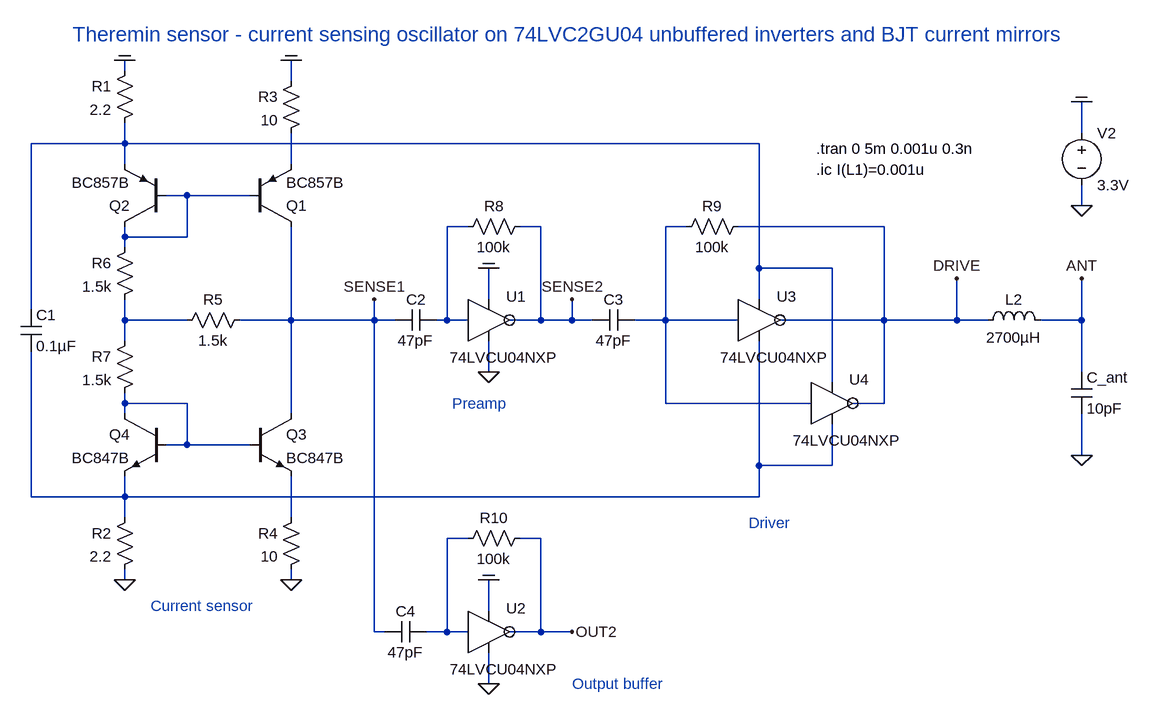
[diagram p0: schematic 2021_current_sensing_unbuffered_inverters_06.asc]
2021_current_sensing_unbuffered_inverters_06.asc, the LTspice schematic file:
Version 4
SHEET 1 13280 8692
WIRE 2560 5792 2560 5776
WIRE 2816 5808 2816 5776
WIRE 4032 5888 4032 5840
WIRE 2560 5904 2560 5872
WIRE 2560 5904 2416 5904
WIRE 3536 5904 2560 5904
WIRE 2560 5936 2560 5904
WIRE 2816 5936 2816 5888
WIRE 2656 5984 2624 5984
WIRE 2752 5984 2656 5984
WIRE 4032 6000 4032 5968
WIRE 3088 6032 3056 6032
WIRE 3200 6032 3168 6032
WIRE 3424 6032 3392 6032
WIRE 3728 6032 3504 6032
WIRE 2560 6048 2560 6032
WIRE 2656 6048 2656 5984
WIRE 2656 6048 2560 6048
WIRE 2560 6064 2560 6048
WIRE 3536 6096 3536 5904
WIRE 3648 6096 3536 6096
WIRE 3120 6144 3120 6096
WIRE 3536 6144 3536 6096
WIRE 2416 6160 2416 5904
WIRE 2560 6176 2560 6144
WIRE 2656 6176 2560 6176
WIRE 2816 6176 2816 6032
WIRE 2816 6176 2736 6176
WIRE 2944 6176 2944 6144
WIRE 2944 6176 2816 6176
WIRE 2976 6176 2944 6176
WIRE 3056 6176 3056 6032
WIRE 3056 6176 3040 6176
WIRE 3088 6176 3056 6176
WIRE 3200 6176 3200 6032
WIRE 3200 6176 3152 6176
WIRE 3248 6176 3248 6144
WIRE 3248 6176 3200 6176
WIRE 3280 6176 3248 6176
WIRE 3392 6176 3392 6032
WIRE 3392 6176 3344 6176
WIRE 3504 6176 3392 6176
WIRE 3728 6176 3728 6032
WIRE 3728 6176 3568 6176
WIRE 3840 6176 3840 6112
WIRE 3840 6176 3728 6176
WIRE 3888 6176 3840 6176
WIRE 4032 6176 4032 6112
WIRE 4032 6176 3968 6176
WIRE 2560 6208 2560 6176
WIRE 3120 6256 3120 6208
WIRE 4032 6256 4032 6176
WIRE 3648 6272 3648 6096
WIRE 2560 6304 2560 6288
WIRE 2656 6304 2560 6304
WIRE 3392 6304 3392 6176
WIRE 3616 6304 3392 6304
WIRE 3728 6304 3728 6176
WIRE 3728 6304 3680 6304
WIRE 2560 6320 2560 6304
WIRE 2816 6320 2816 6176
WIRE 2656 6368 2656 6304
WIRE 2656 6368 2624 6368
WIRE 2752 6368 2656 6368
WIRE 4032 6384 4032 6320
WIRE 3536 6400 3536 6208
WIRE 3648 6400 3648 6336
WIRE 3648 6400 3536 6400
WIRE 2416 6448 2416 6224
WIRE 2560 6448 2560 6416
WIRE 2560 6448 2416 6448
WIRE 3536 6448 3536 6400
WIRE 3536 6448 2560 6448
WIRE 2560 6480 2560 6448
WIRE 2816 6480 2816 6416
WIRE 3088 6512 3056 6512
WIRE 3200 6512 3168 6512
WIRE 2560 6576 2560 6560
WIRE 2816 6576 2816 6560
WIRE 3120 6624 3120 6576
WIRE 2944 6656 2944 6176
WIRE 2960 6656 2944 6656
WIRE 3056 6656 3056 6512
WIRE 3056 6656 3024 6656
WIRE 3088 6656 3056 6656
WIRE 3200 6656 3200 6512
WIRE 3200 6656 3152 6656
WIRE 3248 6656 3200 6656
WIRE 3120 6736 3120 6688
FLAG 4032 6000 0
FLAG 4032 5840 COM
FLAG 2816 5776 COM
FLAG 2816 6576 0
FLAG 3120 6096 COM
FLAG 3120 6256 0
FLAG 3248 6144 SENSE2
FLAG 2560 5776 COM
FLAG 2560 6576 0
FLAG 4032 6112 ANT
FLAG 4032 6384 0
FLAG 3840 6112 DRIVE
FLAG 3120 6576 COM
FLAG 3120 6736 0
FLAG 3248 6656 OUT2
FLAG 2944 6144 SENSE1
SYMBOL voltage 4032 5872 R0
WINDOW 123 0 0 Left 2
WINDOW 39 0 0 Left 2
SYMATTR InstName V2
SYMATTR Value 3.3V
SYMBOL pnp 2752 6032 M180
SYMATTR InstName Q1
SYMATTR Value BC857B
SYMBOL pnp 2624 6032 R180
SYMATTR InstName Q2
SYMATTR Value BC857B
SYMBOL npn 2752 6320 R0
SYMATTR InstName Q3
SYMATTR Value BC847B
SYMBOL npn 2624 6320 M0
SYMATTR InstName Q4
SYMATTR Value BC847B
SYMBOL res 2752 6160 R90
WINDOW 0 0 56 VBottom 2
WINDOW 3 32 56 VTop 2
SYMATTR InstName R5
SYMATTR Value 1.5k
SYMBOL res 2832 5792 M0
WINDOW 0 36 40 Left 2
WINDOW 3 36 76 Left 2
SYMATTR InstName R3
SYMATTR Value 10
SYMBOL res 2832 6464 M0
WINDOW 0 36 40 Left 2
WINDOW 3 36 76 Left 2
SYMATTR InstName R4
SYMATTR Value 10
SYMBOL res 2576 6048 M0
WINDOW 0 36 40 Left 2
WINDOW 3 36 76 Left 2
SYMATTR InstName R6
SYMATTR Value 1.5k
SYMBOL res 2576 6192 M0
WINDOW 0 36 40 Left 2
WINDOW 3 36 76 Left 2
SYMATTR InstName R7
SYMATTR Value 1.5k
SYMBOL cap 3040 6160 R90
WINDOW 0 0 32 VBottom 2
WINDOW 3 32 32 VTop 2
SYMATTR InstName C2
SYMATTR Value 47pF
SYMBOL 74LVCU04NXP 3120 6176 R0
SYMATTR InstName U1
SYMBOL res 3184 6016 R90
WINDOW 0 0 56 VBottom 2
WINDOW 3 32 56 VTop 2
SYMATTR InstName R8
SYMATTR Value 100k
SYMBOL 74LVCU04NXP 3536 6176 R0
SYMATTR InstName U3
SYMBOL res 3520 6016 R90
WINDOW 0 0 56 VBottom 2
WINDOW 3 32 56 VTop 2
SYMATTR InstName R9
SYMATTR Value 100k
SYMBOL cap 3344 6160 R90
WINDOW 0 0 32 VBottom 2
WINDOW 3 32 32 VTop 2
SYMATTR InstName C3
SYMATTR Value 47pF
SYMBOL 74LVCU04NXP 3648 6304 R0
SYMATTR InstName U4
SYMBOL res 2576 5776 M0
WINDOW 0 36 40 Left 2
WINDOW 3 36 76 Left 2
SYMATTR InstName R1
SYMATTR Value 2.2
SYMBOL res 2576 6464 M0
WINDOW 0 36 40 Left 2
WINDOW 3 36 76 Left 2
SYMATTR InstName R2
SYMATTR Value 2.2
SYMBOL ind 3872 6192 R270
WINDOW 0 32 56 VTop 2
WINDOW 3 5 56 VBottom 2
SYMATTR InstName L2
SYMATTR Value 2700µH
SYMATTR SpiceLine Rser=120 Cpar=1.2pF
SYMBOL cap 4016 6256 R0
SYMATTR InstName C_ant
SYMATTR Value 10pF
SYMBOL cap 2400 6160 R0
SYMATTR InstName C1
SYMATTR Value 0.1µF
SYMBOL cap 3024 6640 R90
WINDOW 0 0 32 VBottom 2
WINDOW 3 32 32 VTop 2
SYMATTR InstName C4
SYMATTR Value 47pF
SYMBOL 74LVCU04NXP 3120 6656 R0
SYMATTR InstName U2
SYMBOL res 3184 6496 R90
WINDOW 0 0 56 VBottom 2
WINDOW 3 32 56 VTop 2
SYMATTR InstName R10
SYMATTR Value 100k
TEXT 3624 5912 Left 2 !.tran 0 5m 0.001u 0.3n
TEXT 2480 5736 Left 3 ;Theremin sensor - current sensing oscillator on 74LVC2GU04 unbuffered inverters and BJT current mirrors
TEXT 3624 5944 Left 2 !.ic I(L1)=0.001u
TEXT 2600 6616 Left 2 ;Current sensor
TEXT 3064 6304 Left 2 ;Preamp
TEXT 3520 6488 Left 2 ;Driver
TEXT 3248 6736 Left 2 ;Output buffer

The netlist it stands for:
* 2021_current_sensing_unbuffered_inverters_06.asc
V2 COM 0 3.3V
Q1 SENSE1 N003 N002 0 BC857B
Q2 N003 N003 N001 0 BC857B
Q3 SENSE1 N007 N009 0 BC847B
Q4 N007 N007 N008 0 BC847B
R5 SENSE1 N006 1.5k
R3 COM N002 10
R4 N009 0 10
R6 N003 N006 1.5k
R7 N006 N007 1.5k
C2 N004 SENSE1 47pF
XU1 N004 SENSE2 COM 0 74LVCU04NXP  ; pins A Y VCC AGND
R8 SENSE2 N004 100k
XU3 N005 DRIVE N001 N008 74LVCU04NXP  ; pins A Y VCC AGND
R9 DRIVE N005 100k
C3 N005 SENSE2 47pF
XU4 N005 DRIVE N001 N008 74LVCU04NXP  ; pins A Y VCC AGND
R1 COM N001 2.2
R2 N008 0 2.2
L2 DRIVE ANT 2700µH Rser=120 Cpar=1.2pF
C_ant ANT 0 10pF
C1 N001 N008 0.1µF
C4 N010 SENSE1 47pF
XU2 N010 OUT2 COM 0 74LVCU04NXP  ; pins A Y VCC AGND
R10 OUT2 N010 100k
.model NPN NPN
.model PNP PNP
.lib standard.bjt
.tran 0 5m 0.001u 0.3n
* Theremin sensor - current sensing oscillator on 74LVC2GU04 unbuffered inverters and BJT current mirrors
.ic I(L1)=0.001u
* Current sensor
* Preamp
* Driver
* Output buffer
.lib 74LVCU04NXP.cir
.backanno
.end